# EAGLE design SND_Replacement (EAGLE 9.6.2)
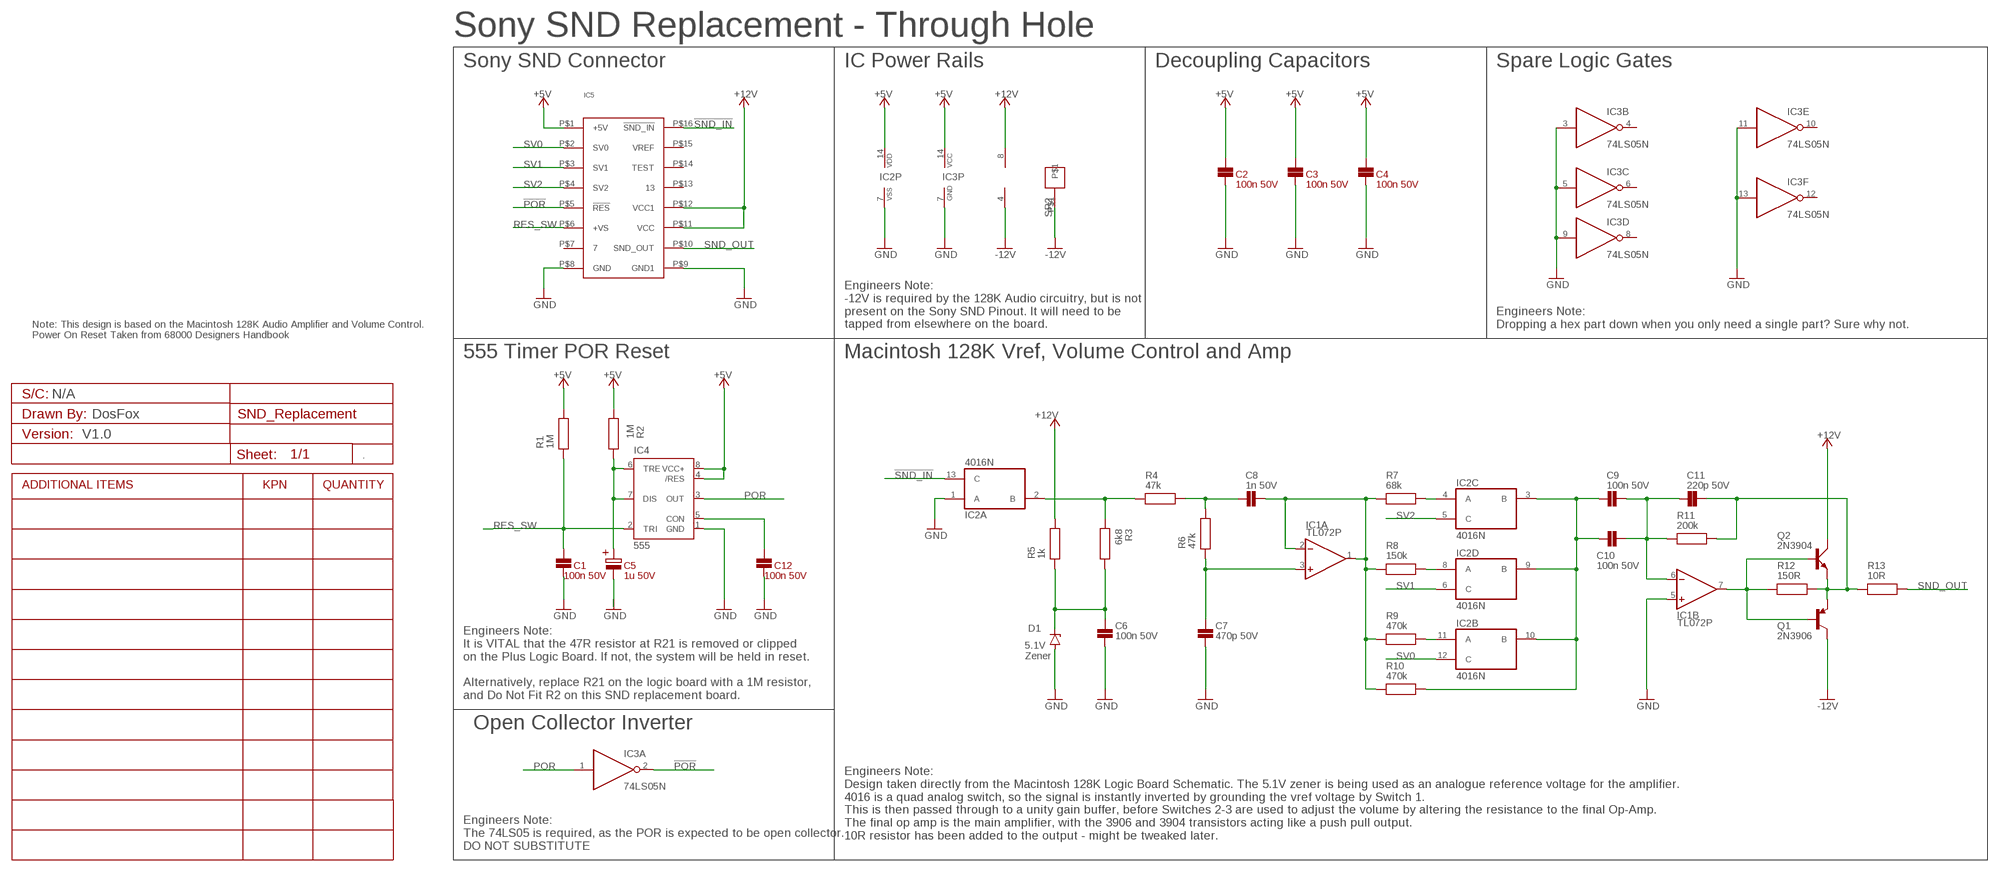
[diagram p0: schematic, sheet 1]

## Parts
A1  V1.0  PROJECT_DETAILS_CUSTOM  [PCB_CUSTOM_DETAILS]
C1  100n 50V  100N_TH_CAP  [CAP_5.08MM_PITCH]
C2  100n 50V  100N_TH_CAP  [CAP_5.08MM_PITCH]
C3  100n 50V  100N_TH_CAP  [CAP_5.08MM_PITCH]
C4  100n 50V  100N_TH_CAP  [CAP_5.08MM_PITCH]
C5  1u 50V  1U_TH_ELEC_CAPVERTICAL  [CAP_ELECTROLYTIC]
C6  100n 50V  100N_TH_CAP  [CAP_5.08MM_PITCH]
C7  470p 50V  470P_TH_CAP  [CAP_5.08MM_PITCH]
C8  1n 50V  1N_TH_CAP  [CAP_5.08MM_PITCH]
C9  100n 50V  100N_TH_CAP  [CAP_5.08MM_PITCH]
C10  100n 50V  100N_TH_CAP  [CAP_5.08MM_PITCH]
C11  220p 50V  220P_TH_CAP  [CAP_5.08MM_PITCH]
C12  100n 50V  100N_TH_CAP  [CAP_5.08MM_PITCH]
D1  ZENER-DIODEF126-10  [F126Z10]
IC1  TL072P  [DIL08]
IC2  4016N  [DIL14]
IC3  74LS05N  [DIL14]
IC4  555  555P  [DIP08]
IC5  SND  [DIP16]
Q1  2N3906  [TO92]
Q2  2N3904  [TO92D]
R1  1M  1M_TH_RESISTOR  [RESISTORTHRUHOLE]
R2  1M  1M_TH_RESISTOR  [RESISTORTHRUHOLE]
R3  6k8  6K8_TH_RESISTOR  [RESISTORTHRUHOLE]
R4  47k  47K_TH_RESISTOR  [RESISTORTHRUHOLE]
R5  1k  1K_TH_RESISTOR  [RESISTORTHRUHOLE]
R6  47k  47K_TH_RESISTOR  [RESISTORTHRUHOLE]
R7  68k  68K_TH_RESISTOR  [RESISTORTHRUHOLE]
R8  150k  150K_TH_RESISTOR  [RESISTORTHRUHOLE]
R9  470k  470K_TH_RESISTOR  [RESISTORTHRUHOLE]
R10  470k  470K_TH_RESISTOR  [RESISTORTHRUHOLE]
R11  200k  100K_TH_RESISTOR  [RESISTORTHRUHOLE]
R12  150R  150K_TH_RESISTOR  [RESISTORTHRUHOLE]
R13  10R  10R_TH_RESISTOR  [RESISTORTHRUHOLE]
SP2  1PIN  [1PIN]

## Nets
!POR: IC3.2(A:O) IC5.P$5(!RES)
!SND_IN: IC2.13(A:C) IC5.P$16(!SND_IN)
+5V: C2.P$2 C3.P$2 C4.P$2 IC2.14(P:VDD) IC3.14(P:VCC) IC4.4(/RES) IC4.8(VCC+) IC5.P$1(+5V) R1.P$2 R2.P$2 ; supply symbol labelled VCC
+12V: IC1.8(P:V+) IC5.P$11(VCC) IC5.P$12(VCC1) Q2.C R5.P$2 ; supply symbol labelled VCC
-12V: IC1.4(P:V-) Q1.1(C) SP2.P$1 ; supply symbol labelled GND
GND: C1.P$1 C2.P$1 C3.P$1 C4.P$1 C5.P$2 C6.P$1 C7.P$1 C12.P$1 D1.A IC1.5(B:+IN) IC2.1(A:A) IC2.7(P:VSS) IC3.3(B:I) IC3.5(C:I) IC3.7(P:GND) IC3.9(D:I) IC3.11(E:I) IC3.13(F:I) IC4.1(GND) IC5.P$8(GND) IC5.P$9(GND1)
N$1: IC2.2(A:B) R3.P$1 R4.P$1
N$2: C12.P$2 IC4.5(CON)
N$3: C9.P$1 C10.P$1 IC2.3(C:B) IC2.9(D:B) IC2.10(B:B) R10.P$2
N$4: C8.P$1 R4.P$2 R6.P$2
N$5: C6.P$2 D1.C R3.P$2 R5.P$1
N$6: C7.P$2 IC1.3(A:+IN) R6.P$1
N$7: IC2.4(C:A) R7.P$2
N$8: IC2.8(D:A) R8.P$2
N$9: IC2.11(B:A) R9.P$2
N$10: C9.P$2 C10.P$2 C11.P$1 IC1.6(B:-IN) R11.P$1
N$12: C8.P$2 IC1.1(A:OUT) IC1.2(A:-IN) R7.P$1 R8.P$1 R9.P$1 R10.P$1
N$13: C11.P$2 Q1.3(E) Q2.E R11.P$2 R12.P$2 R13.P$1
N$15: IC1.7(B:OUT) Q1.2(B) Q2.B R12.P$1
POR: IC3.1(A:I) IC4.3(OUT)
RES_SW: C1.P$2 IC4.2(TRI) IC5.P$6(+VS) R1.P$1
RES_SW1: C5.P$1 IC4.6(TRE) IC4.7(DIS) R2.P$1
SND_OUT: IC5.P$10(SND_OUT) R13.P$2
SV0: IC2.12(B:C) IC5.P$2(SV0)
SV1: IC2.6(D:C) IC5.P$3(SV1)
SV2: IC2.5(C:C) IC5.P$4(SV2)
Unconnected: IC3.4(B:O) IC3.6(C:O) IC3.8(D:O) IC3.10(E:O) IC3.12(F:O) IC5.P$7 IC5.P$13 IC5.P$14(TEST) IC5.P$15(VREF)

## Notes on the sheet
- Sony SND Replacement - Through Hole
- Sony SND Connector | IC Power Rails | Decoupling Capacitors | Spare Logic Gates
- Engineers Note:
  -12V is required by the 128K Audio circuitry, but is not 
  present on the Sony SND Pinout. It will need to be 
  tapped from elsewhere on the board.
- Engineers Note:
  Dropping a hex part down when you only need a single part? Sure why not.
- Note: This design is based on the Macintosh 128K Audio Amplifier and Volume Control. 
  Power On Reset Taken from 68000 Designers Handbook
- 555 Timer POR Reset | Macintosh 128K Vref, Volume Control and Amp
- N/A
- DosFox
- 5.1V
  Zener
- Engineers Note:
  It is VITAL that the 47R resistor at R21 is removed or clipped
  on the Plus Logic Board. If not, the system will be held in reset. 
  
  Alternatively, replace R21 on the logic board with a 1M resistor,
  and Do Not Fit R2 on this SND replacement board.
- Open Collector Inverter
- Engineers Note:
  Design taken directly from the Macintosh 128K Logic Board Schematic. The 5.1V zener is being used as an analogue reference voltage for the amplifier. 
  4016 is a quad analog switch, so the signal is instantly inverted by grounding the vref voltage by Switch 1. 
  This is then passed through to a unity gain buffer, before Switches 2-3 are used to adjust the volume by altering the resistance to the final Op-Amp. 
  The final op amp is the main amplifier, with the 3906 and 3904 transistors acting like a push pull output.
  10R resistor has been added to the output - might be tweaked later.
- Engineers Note:
  The 74LS05 is required, as the POR is expected to be open collector.
  DO NOT SUBSTITUTE

## Library data of the parts
A1 = Schematic Symbols:PROJECT_DETAILS; VALUE: VDEV1
C1-C4 C6 C9 C10 C12 = Capacitors TH:100N_TH_CAP; COMPONENT: Capacitor; COST: =(INDIRECT(ADDRESS(ROW(),1)))*(INDIRECT(ADDRESS(ROW(),13))); EA: =VLOOKUP(INDIRECT(ADDRESS(ROW(),7)),[ProductCosts.xlsx]StockCosts!$A:$B,2,FALSE); KPN: 3101-100N; PACKAGE: 5.08mm PITCH; PROCESS: TH
C5 = Capacitors TH:1U_TH_ELEC_CAP; COMPONENT: Capacitor Electrolytic; COST: =(INDIRECT(ADDRESS(ROW(),1)))*(INDIRECT(ADDRESS(ROW(),13))); EA: =VLOOKUP(INDIRECT(ADDRESS(ROW(),7)),[ProductCosts.xlsx]StockCosts!$A:$B,2,FALSE); KPN: 3102-1U; PACKAGE: 5mm DIA; PROCESS: TH
C7 = Capacitors TH:470P_TH_CAP; COMPONENT: Capacitor; COST: =(INDIRECT(ADDRESS(ROW(),1)))*(INDIRECT(ADDRESS(ROW(),13))); EA: =VLOOKUP(INDIRECT(ADDRESS(ROW(),7)),[ProductCosts.xlsx]StockCosts!$A:$B,2,FALSE); KPN: 3101-470P; PACKAGE: 5.08mm PITCH; PROCESS: TH
C8 = Capacitors TH:1N_TH_CAP; COMPONENT: Capacitor; COST: =(INDIRECT(ADDRESS(ROW(),1)))*(INDIRECT(ADDRESS(ROW(),13))); EA: =VLOOKUP(INDIRECT(ADDRESS(ROW(),7)),[ProductCosts.xlsx]StockCosts!$A:$B,2,FALSE); KPN: 3101-1N; PACKAGE: 5.08mm PITCH; PROCESS: TH
C11 = Capacitors TH:220P_TH_CAP; COMPONENT: Capacitor; COST: =(INDIRECT(ADDRESS(ROW(),1)))*(INDIRECT(ADDRESS(ROW(),13))); EA: =VLOOKUP(INDIRECT(ADDRESS(ROW(),7)),[ProductCosts.xlsx]StockCosts!$A:$B,2,FALSE); KPN: 3101-220P; PACKAGE: 5.08mm PITCH; PROCESS: TH
D1 = diode:ZENER-DIODE: Z-Diode
IC1 = linear:TL072: OP AMP
IC2 = 40xx:4016: Quad bilateral ANALOG SWITCH
IC3 = 74xx-eu:74*05: Hex INVERTER, open collector
IC4 = SparkFun-IC-Special-Function:555: General purpose bipolar Timer Datasheet <http://www.sparkfun.com/datasheets/Components/General/ne555.pdf> SparkFun Products SparkFun SparkPunk Sequencer Kit <https://www.sparkfun.com/products/12707> (KIT-12707) Storefront Component: 555 Timer <https://www.sparkfun.com/products/9273> (COM-09273) Two parts valid for production: VFP: IC-11930 (M7555 PTH) VFP: IC-09173 (555 PTH) - Preferred; PROD_ID: IC-09173; PROD_ID_ALT: IC-09173
IC5 = ICs:SND; PACKAGE: DIP16; PROCESS: TH
Q1 = transistor-pnp:2N3906: PNP Transistor
Q2 = transistor-small-signal:2N3904: NPN TRANSISTOR
R1 R2 = Resistors TH:1M_TH_RESISTOR; COMPONENT: Resistor; COST: =(INDIRECT(ADDRESS(ROW(),1)))*(INDIRECT(ADDRESS(ROW(),13))); EA: =(VLOOKUP(INDIRECT(ADDRESS(ROW(),6)),[ProductCosts.xlsx]StockCosts!$A:$B,2,FALSE))/1000; KPN: 3004-1M; PACKAGE: Axial Leaded; PROCESS: TH
R3 = Resistors TH:6K8_TH_RESISTOR; COMPONENT: Resistor; COST: =(INDIRECT(ADDRESS(ROW(),1)))*(INDIRECT(ADDRESS(ROW(),13))); EA: =(VLOOKUP(INDIRECT(ADDRESS(ROW(),6)),[ProductCosts.xlsx]StockCosts!$A:$B,2,FALSE))/1000; KPN: 3004-6k8; PACKAGE: Axial Leaded; PROCESS: TH
R4 R6 = Resistors TH:47K_TH_RESISTOR; COMPONENT: Resistor; COST: =(INDIRECT(ADDRESS(ROW(),1)))*(INDIRECT(ADDRESS(ROW(),13))); EA: =(VLOOKUP(INDIRECT(ADDRESS(ROW(),6)),[ProductCosts.xlsx]StockCosts!$A:$B,2,FALSE))/1000; KPN: 3004-47k; PACKAGE: Axial Leaded; PROCESS: TH
R5 = Resistors TH:1K_TH_RESISTOR; COMPONENT: Resistor; COST: =(INDIRECT(ADDRESS(ROW(),1)))*(INDIRECT(ADDRESS(ROW(),13))); EA: =(VLOOKUP(INDIRECT(ADDRESS(ROW(),6)),[ProductCosts.xlsx]StockCosts!$A:$B,2,FALSE))/1000; KPN: 3004-1k; PACKAGE: Axial Leaded; PROCESS: TH
R7 = Resistors TH:68K_TH_RESISTOR; COMPONENT: Resistor; COST: =(INDIRECT(ADDRESS(ROW(),1)))*(INDIRECT(ADDRESS(ROW(),13))); EA: =(VLOOKUP(INDIRECT(ADDRESS(ROW(),6)),[ProductCosts.xlsx]StockCosts!$A:$B,2,FALSE))/1000; KPN: 3004-68k; PACKAGE: Axial Leaded; PROCESS: TH
R8 = Resistors TH:150K_TH_RESISTOR; COMPONENT: Resistor; COST: =(INDIRECT(ADDRESS(ROW(),1)))*(INDIRECT(ADDRESS(ROW(),13))); EA: =(VLOOKUP(INDIRECT(ADDRESS(ROW(),6)),[ProductCosts.xlsx]StockCosts!$A:$B,2,FALSE))/1000; KPN: 3004-150k; PACKAGE: Axial Leaded; PROCESS: TH
R9 R10 = Resistors TH:470K_TH_RESISTOR; COMPONENT: Resistor; COST: =(INDIRECT(ADDRESS(ROW(),1)))*(INDIRECT(ADDRESS(ROW(),13))); EA: =(VLOOKUP(INDIRECT(ADDRESS(ROW(),6)),[ProductCosts.xlsx]StockCosts!$A:$B,2,FALSE))/1000; KPN: 3004-470k; PACKAGE: Axial Leaded; PROCESS: TH
R11 = Resistors TH:100K_TH_RESISTOR; COMPONENT: Resistor; COST: =(INDIRECT(ADDRESS(ROW(),1)))*(INDIRECT(ADDRESS(ROW(),13))); EA: =(VLOOKUP(INDIRECT(ADDRESS(ROW(),6)),[ProductCosts.xlsx]StockCosts!$A:$B,2,FALSE))/1000; KPN: 3004-100k; PACKAGE: Axial Leaded; PROCESS: TH; VALUE: 100k
R12 = Resistors TH:150K_TH_RESISTOR; COMPONENT: Resistor; COST: =(INDIRECT(ADDRESS(ROW(),1)))*(INDIRECT(ADDRESS(ROW(),13))); EA: =(VLOOKUP(INDIRECT(ADDRESS(ROW(),6)),[ProductCosts.xlsx]StockCosts!$A:$B,2,FALSE))/1000; KPN: 3004-150k; PACKAGE: Axial Leaded; PROCESS: TH; VALUE: 150k
R13 = Resistors TH:10R_TH_RESISTOR; COMPONENT: Resistor; COST: =(INDIRECT(ADDRESS(ROW(),1)))*(INDIRECT(ADDRESS(ROW(),13))); EA: =(VLOOKUP(INDIRECT(ADDRESS(ROW(),6)),[ProductCosts.xlsx]StockCosts!$A:$B,2,FALSE))/1000; KPN: 3004-10R; PACKAGE: Axial Leaded; PROCESS: TH
SP2 = generic parts:1PIN

## Board
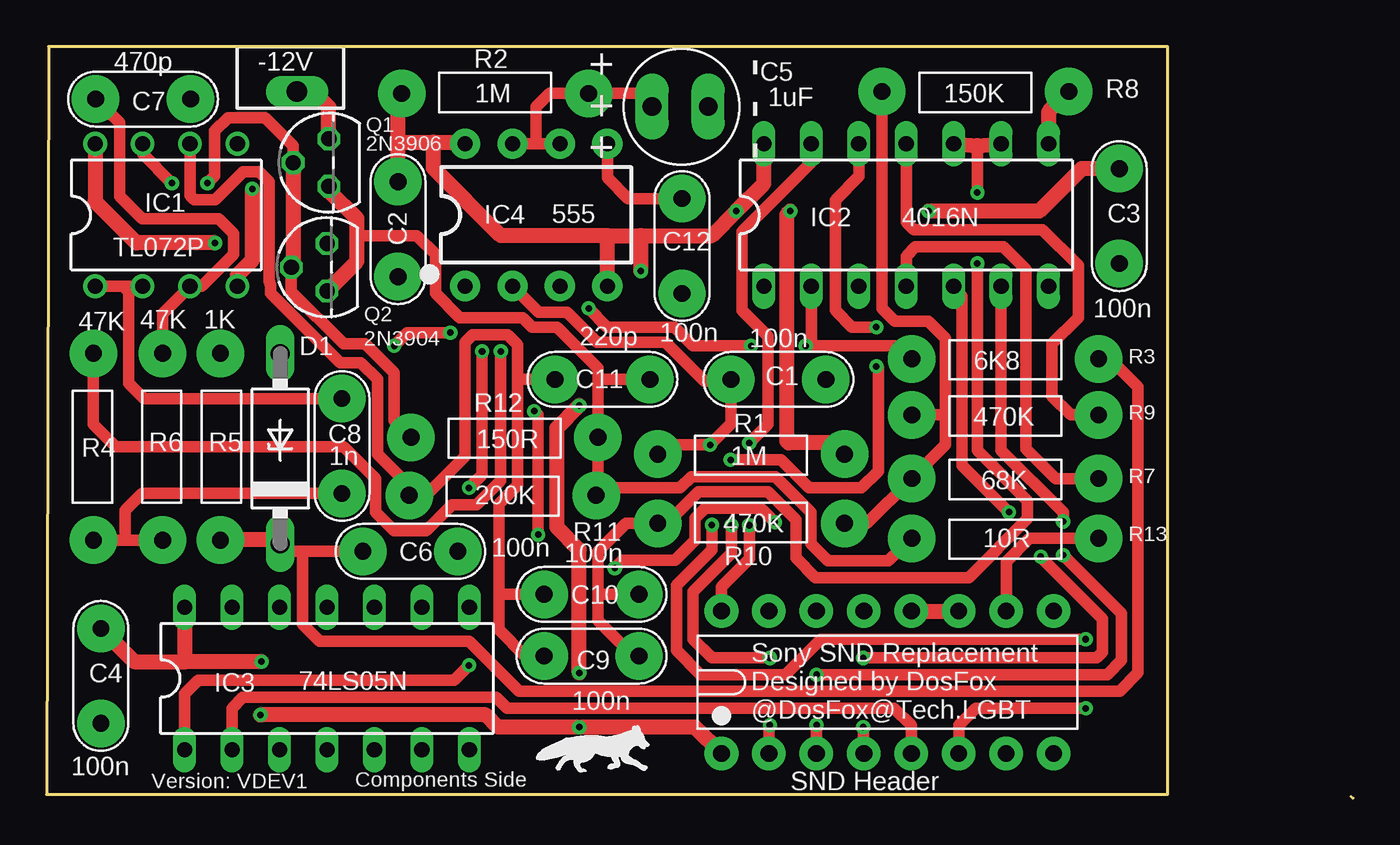
[diagram p1: board, top side]
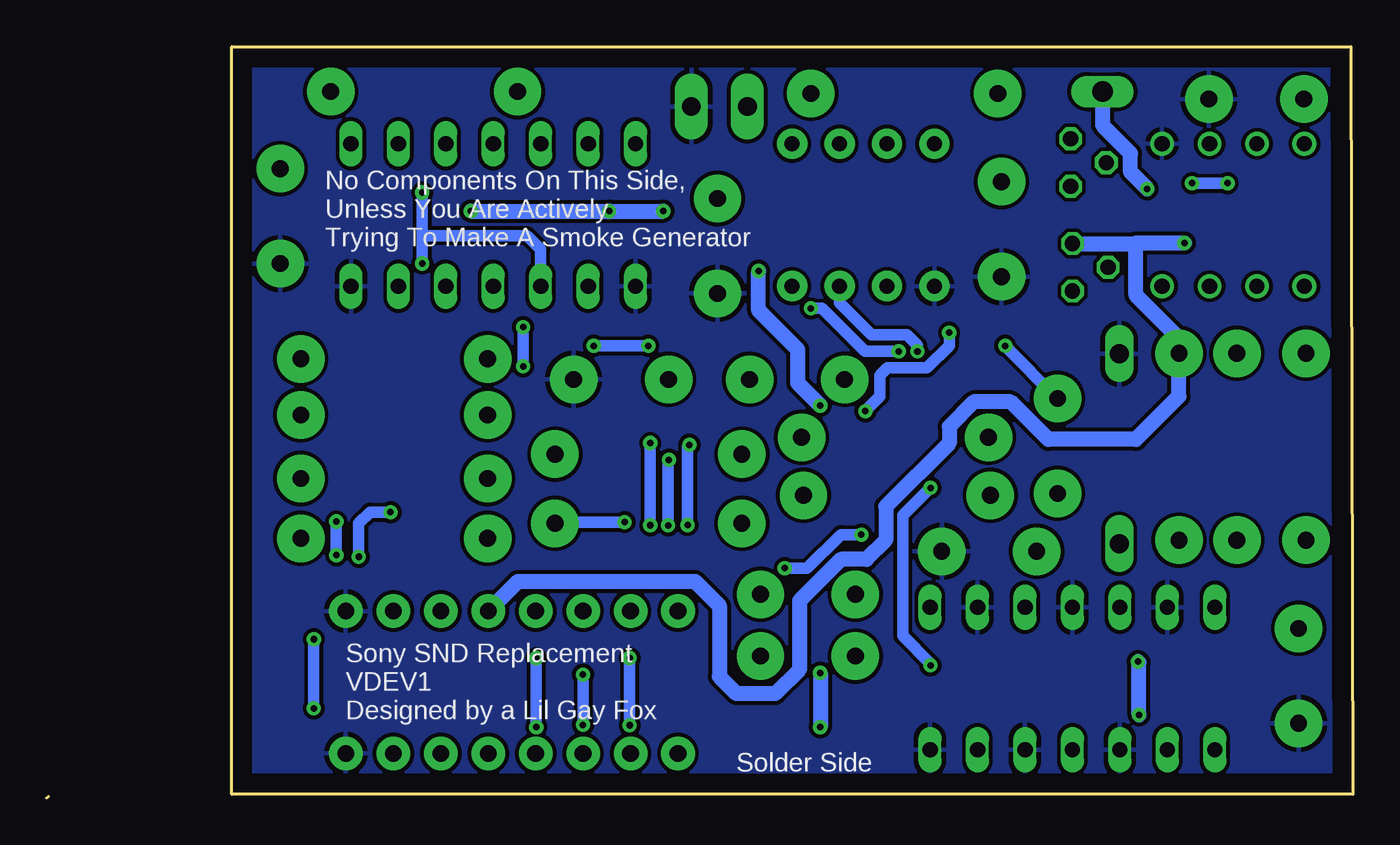
[diagram p2: board, bottom side, seen from below]

Size 69.9 x 40.2 mm. Coordinates in mm from the lower left corner, seen from the top.
Outline: 69.8,0.1 69.9,0
Outline: 0,0.2 60,0.2 60,40.2 0.1,40.2 0,0.2
Copper layers (1*16): Top 0.035mm / dielectric 1.5mm / Bottom 0.035mm
Design rules "default *": minimum track width 0.2mm, minimum drill 0.25mm, track to track 8mil, track to pad 8mil, pad to pad 8mil, via to via 8mil, smd to smd 8mil, copper to edge 40mil, drill to drill 8mil, minimum pad ring 1mil, minimum via ring 8mil, stop-mask expansion 4mil, vias tented up to drill 1mm, thermal gap 10mil

### Footprints (pad centres in the part's own frame; a part is rotated, then mirrored left to right if it is on the bottom)
CAP_5.08MM_PITCH = drill 0.9 pad 2.54: P$1 0,0; P$2 0,-5.08
CAP_ELECTROLYTIC = drill 1 pad 1.778 long: P$1 0,0; P$2 0,-3
F126Z10 = drill 1.016 long: A 5.08,0; C -5.08,0
DIL08 = drill 0.813 pad 1.27: 1 -3.81,-3.81; 2 -1.27,-3.81; 3 1.27,-3.81; 4 3.81,-3.81; 5 3.81,3.81; 6 1.27,3.81; 7 -1.27,3.81; 8 -3.81,3.81
DIL14 = drill 0.813 long: 1 -7.62,-3.81; 2 -5.08,-3.81; 3 -2.54,-3.81; 4 0,-3.81; 5 2.54,-3.81; 6 5.08,-3.81; 7 7.62,-3.81; 8 7.62,3.81; 9 5.08,3.81; 10 2.54,3.81; 11 0,3.81; 12 -2.54,3.81; 13 -5.08,3.81; 14 -7.62,3.81
DIP08 = drill 0.813 pad 1.626: 1 -3.81,-3.81; 2 -1.27,-3.81; 3 1.27,-3.81; 4 3.81,-3.81; 5 3.81,3.81; 6 1.27,3.81; 7 -1.27,3.81; 8 -3.81,3.81
DIP16 = drill 0.9 pad 1.8: P$1 -8.89,-3.81; P$2 -6.35,-3.81; P$3 -3.81,-3.81; P$4 -1.27,-3.81; P$5 1.27,-3.81; P$6 3.81,-3.81; P$7 6.35,-3.81; P$8 8.89,-3.81; P$9 8.89,3.81; P$10 6.35,3.81; P$11 3.81,3.81; P$12 1.27,3.81; P$13 -1.27,3.81; P$14 -3.81,3.81; P$15 -6.35,3.81; P$16 -8.89,3.81
TO92 = drill 0.813 octagon: 1 1.27,0; 2 0,1.905; 3 -1.27,0
TO92D = drill 0.813 octagon: B 0,1.905; C 1.27,0; E -1.27,0
RESISTORTHRUHOLE = drill 0.9 pad 2.54: P$1 0,0; P$2 10,0
1PIN = drill 1.1 pad 1.676 long: P$1 0,0

### Placement (x,y rotation side)
A1  -120.65,1.47 0 top  (outside the outline)
C1  41.7,22.4 270 top
C2  18.8,27.9 180 top
C3  57.4,28.6 180 top
C4  2.9,4 180 top
C5  32.4,37 90 top
C6  22,13.2 270 top
C7  7.7,37.4 270 top
C8  15.8,16.3 180 top
C9  31.7,7.6 270 top
C10  31.7,10.9 270 top
C11  27.2,22.4 90 top
C12  34,27 180 top
D1  12.5,18.7 90 top
IC1  6.4,31.2 0 top
IC2  46,31.2 0 top
IC3  15,6.4 0 top
IC4  26.2,31.2 0 top
IC5  45,6.2 0 top
Q1  15.1,34 90 top
Q2  15,28.4 90 top
R1  32.7,18.4 0 top
R2  29,37.7 180 top
R3  46.3,23.5 0 top
R4  2.5,23.8 270 top
R5  9.3,13.8 90 top
R6  6.2,23.8 270 top
R7  46.3,17.1 0 top
R8  44.7,37.8 0 top
R9  46.3,20.5 0 top
R10  42.7,14.7 180 top
R11  19.4,16.2 0 top
R12  19.5,19.3 0 top
R13  46.3,13.9 0 top
SP2  13.4,37.8 180 top

### Tracks (layer width: path | path; a pad name or v marks a point on that pad's centre or on a via)
!POR
  Top 0.61: IC5.P$5 46.27,3.89 45.35,4.81 24.65,4.81 24.06,5.4 10.5,5.4 9.92,4.82 IC3.2
!SND_IN  (via drill 0.35)
  Top 0.61: v37.6,14.6 37.6,12.8 36.11,11.31 IC5.P$16 | v37.6,19 38.6,20 38.6,24.7 37.2,26.1 37.2,30.29 40.92,34.01 IC2.13
  Bottom 0.61: v37.6,19 v37.6,14.6
+5V  (via drill 0.35)
  Top 0.813: C2.P$2 18.8,35.1 | 18.8,35.1 18.8,37.5 R2.P$2 | 18.8,35.1 20.7,35.1 | 20.7,35.1 22.3,35.1 IC4.8 | IC4.4 30.01,30.1 | 20.7,35.1 20.7,33.7 24.3,30.1 30.01,30.1 | IC5.P$1 34.7,3.8 v28.5,3.8 24.17,3.8 23.51,4.45 v11.45,4.45 | C4.P$2 4.68,7.3 7.5,7.3 | 30.01,30.1 31.8,30.1 | 31.8,30.1 35.6,30.1 v36.9,31.4 38.38,32.88 IC2.14 | C3.P$2 55.4,33.68 53.12,31.4 v47.2,31.4 | v28.5,21 27.3,19.8 27.3,14.5 28.5,13.3 v28.5,6.7 | v31.8,28.2 31.8,30.1 | R1.P$2 42.1,19 39.7,19 39.6,19.1 39.6,31.2 v39.8,31.4 | v11.5,7.3 7.5,7.3 | IC3.14 7.38,7.42 7.5,7.3
  Bottom 0.813: v11.45,4.45 11.45,7.25 v11.5,7.3 | v28.5,6.7 v28.5,3.8 | v47.2,31.4 v39.8,31.4 v36.9,31.4 | v28.5,21 29.7,22.2 29.7,24 31.8,26.1 v31.8,28.2
+12V  (via drill 0.35)
  Top 0.813: IC5.P$12 IC5.P$11 | IC1.8 2.59,31.91 4.8,29.7 v9.01,29.7
  Bottom 0.813: 11.6,29.7 11.6,26.9 9.3,24.6 R5.P$2 9.3,21.5 11.6,19.2 16.3,19.2 18.3,21.2 20.29,21.2 21.6,19.89 21.6,19 24.99,15.6 24.99,13.81 26.02,12.78 27.4,12.78 29.6,10.58 29.6,6.9 30.9,5.6 33,5.6 33.9,6.5 33.9,10.3 35.2,11.6 44.68,11.6 IC5.P$12 | 11.6,29.7 v9.01,29.7 | Q2.C 11.63,29.67 11.6,29.7
-12V  (via drill 0.35)
  Top 0.813: Q1.1 15.1,36.97 14.27,37.8 SP2.P$1 | v11,32.6 11,28.78 10.21,27.99 IC1.4
  Bottom 0.813: v11,32.6 11.9,33.5 11.9,34.5 13.4,36 SP2.P$1
GND
  pour Bottom: 0.1,40.2 0.1,0.1 60.1,0.2 60.1,40.2
N$1  (via drill 0.35)
  Top 0.61: IC2.2 40.92,24.2 v40.62,24.2 45.46,24.2 R3.P$1 | v37.7,24.2 34.6,24.2 33.6,25.2 30,25.2 v29,26.2 | R4.P$1 2.5,20 3.7,18.8 15.9,18.8 17.6,17.1 17.6,15.3 18.6,14.3 20.3,14.3 21.7,15.7 23,15.7 24.29,16.99 24.29,23.89 v24.3,23.9
  Bottom 0.61: v40.62,24.2 v37.7,24.2 | v29,26.2 28.4,26.2 26.1,23.9 v24.3,23.9
N$2
  Top 0.61: C12.P$2 31.12,32.08 30.01,33.19 IC4.5
N$3  (via drill 0.35)
  Top 0.61: C9.P$1 31.4,7.6 29.5,9.5 29.5,10.9 | 29.5,10.9 29.5,13.2 31,14.7 R10.P$2 33.2,14.7 34.89,16.39 38.6,16.39 40.09,14.9 40.09,12.86 41.15,11.8 49.35,11.8 52.49,14.94 52.49,15.91 49.8,18.6 v49.8,28.6 | C10.P$1 29.5,10.9 | 49.8,34.91 v49.8,32.4
  Top 0.813: IC2.10 49.8,34.91 IC2.9
  Bottom 0.61: v49.8,32.4 49.8,30.1 | 49.8,30.1 v49.8,28.6 | IC2.3 43.46,29.36 44.2,30.1 49.8,30.1
N$4
  Top 0.61: R6.P$2 4.2,13.8 | 4.2,13.8 R4.P$2 | 4.2,13.8 4.2,15.4 5.1,16.3 C8.P$1
N$5
  Top 0.61: R3.P$2 56.9,23.5 58.4,22 58.4,6.7 57.42,5.72 25.28,5.72 22.61,8.4 14.6,8.4 13.7,9.3 13.7,13.22 | C6.P$2 16.92,13.22 13.7,13.22 | 13.7,13.22 12.5,13.22 D1.C 12.4,13.62
  Top 0.813: 12.4,13.62 12.2,13.82 9.32,13.82 R5.P$1
N$6
  Top 0.61: R6.P$1 6.2,25.92 IC1.3 8.29,27.39 10,29.1 10,30.2 9.2,31 5.1,31 3.9,32.2 3.9,36.12 C7.P$2
N$7
  Top 0.61: R7.P$2 54,17.1 52.4,18.7 52.4,28.3 51.2,29.5 46.5,29.5 46,29 IC2.4
N$8
  Top 0.813: R8.P$2 53.62,36.71 IC2.8
N$9
  Top 0.61: R9.P$2 54.8,20.5 53.8,21.5 53.8,24.3 55.2,25.7 55.2,28.5 53.3,30.4 46.4,30.4 46,30.8 IC2.11
N$10
  Top 0.61: C9.P$2 25.6,7.6 24.2,9 24.2,11.1 | C11.P$1 25.2,22.4 | 25.2,22.4 25.2,24.25 24.65,24.8 22.8,24.8 22.4,24.4 22.4,18.3 20.3,16.2 R11.P$1 19.4,16.7 17.7,18.4 17.7,22.4 16.8,23.3 15.7,23.3 11.98,27.02 11.98,27.43 11.91,27.69 11.91,32.98 11.38,33.51 10.51,33.51 9.01,32.01 7.89,32.01 7.67,32.23 IC1.6 | 25.2,22.4 25.2,16.75 24.2,15.75 24.2,11.1 | C10.P$2 24.4,10.9 24.2,11.1
N$12  (via drill 0.35)
  Top 0.61: R10.P$1 43.9,14.7 R7.P$1 48.1,18.9 48.1,20.5 | R8.P$1 44.7,26.2 45.4,25.5 47.2,25.5 48.1,24.6 48.1,20.5 | R9.P$1 48.1,20.5 | C8.P$2 5.22,21.38 4.4,22.2 4.4,27.09 4.1,27.39 | v21.6,24.9 19.3,24.9 v18.6,24.2 | v26.09,20.7 26.29,20.5 26.29,14.11 v26.3,14.1 | v30.4,12.3 30.82,12.72 33.62,12.72 34.7,13.8 34.7,14.97 35.23,15.5 38.23,15.5 v38.97,14.77 | IC1.1 4.1,27.39 | 4.1,27.39 IC1.2
  Bottom 0.61: v18.6,24.2 18.6,24.18 C8.P$2 | v30.4,12.3 29.2,12.3 27.4,14.1 v26.3,14.1 | R10.P$1 42.63,14.77 v38.97,14.77 | v21.6,24.9 21.6,24.2 22.79,23.01 24.9,23.01 25.3,22.61 25.3,21.5 26.09,20.71 v26.09,20.7
N$13
  Top 0.61: R13.P$1 46.25,13.9 45.05,12.7 41.8,12.7 40.9,13.6 40.9,15.3 39,17.2 34.5,17.2 33.9,16.6 29.8,16.6 R11.P$2 29.1,16.5 29.1,16.7 29.5,16.7 R12.P$2 29.5,22.4 | 16.6,30.1 19.8,30.1 20.8,29.1 20.8,27 22.1,25.7 25.47,25.7 25.98,25.19 27.31,25.19 29.5,23 29.5,22.4 | C11.P$2 29.5,22.4
  Top 0.813: Q2.E 16.6,28.73 16.6,30.1 16.6,31 15.1,32.5 Q1.3
N$15  (via drill 0.35)
  Top 0.61: R12.P$1 18.6,20.2 18.6,22.75 17.05,24.3 15.89,24.3 13.1,27.1 Q2.B | v8.6,32.9 9,33.3 9,35.7 9.7,36.4 11.7,36.4 13.2,34.9 Q1.2 | v6.7,32.9 5.13,34.47 IC1.7
  Top 0.813: Q1.2 13.2,28.5 Q2.B
  Bottom 0.61: v8.6,32.9 v6.7,32.9
POR  (via drill 0.35)
  Top 0.61: IC3.1 7.38,5.58 8.1,6.3 21.8,6.3 v22.6,7.1 | v23.3,23.9 23.3,17.3 v22.6,16.6
  Bottom 0.61: v22.6,16.6 22.61,16.6 24.08,15.14 24.08,8.68 22.6,7.2 v22.6,7.1 | IC4.3 27.47,26.49 25.77,24.79 23.87,24.79 23.3,24.22 v23.3,23.9
RES_SW  (via drill 0.35)
  Top 0.61: v55.61,4.81 49.73,4.81 48.81,3.89 IC5.P$6 | v35.6,14.61 35.6,13.3 33.7,11.4 33.7,7.9 35,6.6 39.54,6.6 41.44,8.5 v55.6,8.5 | R1.P$1 33.2,18.9 v35.5,18.9 36.62,20.02 C1.P$2 36.52,22.3 35.2,22.3 33.11,24.39 29.46,24.39 27.85,26 26.32,26 IC4.2
  Bottom 0.61: v55.6,8.5 v55.61,8.49 v55.61,4.81 | v35.5,18.9 35.6,18.8 v35.6,14.61
RES_SW1
  Top 0.61: IC4.7 26.2,35.01 | 26.2,35.01 IC4.6 | 26.2,35.01 26.2,37 26.9,37.7 R2.P$1 32,37.7 32.4,37.3 C5.P$1
SND_OUT
  Top 0.61: IC5.P$10 51.35,12.65 52.6,13.9 R13.P$2
SV0  (via drill 0.35)
  Top 0.61: IC2.12 43.46,33.26 42.2,32 42.2,26.1 43.1,25.2 v44.4,25.2 | v44.4,23.1 44.5,23 44.5,17.49 43.61,16.6 40.8,16.6 39.3,18.1 v36.6,18.1 | IC5.P$2 38.65,3.85 v38.7,3.9 | v38.7,7.5 35.6,7.5 34.6,8.5 34.6,11.05 36.21,12.66 36.21,12.67 36.64,13.1 v36.64,14.6
  Bottom 0.61: v44.4,25.2 v44.4,23.1 | v38.7,7.5 v38.7,3.9 | v36.6,18.1 36.64,18.1 v36.64,14.6
SV1  (via drill 0.35)
  Top 0.61: IC2.6 51.08,18.62 54.4,15.3 v54.4,14.8 | v54.4,13 57.51,9.89 57.51,7.36 56.76,6.61 v41.2,6.61 | v41.2,3.92 IC5.P$3
  Bottom 0.61: v54.4,14.8 v54.4,13 | v41.2,6.61 v41.2,3.92
SV2  (via drill 0.35)
  Top 0.61: IC2.5 48.99,26.84 48.99,17.81 v51.5,15.3 | v53.2,12.91 v53.2,12.9 56.5,9.6 56.5,7.8 56.21,7.51 43.71,7.51 v43.7,7.5 | v43.7,3.8 43.7,2.42 IC5.P$4
  Bottom 0.61: v51.5,15.3 52.6,15.3 53.2,14.7 v53.2,12.91 | v43.7,7.5 v43.7,3.8

### Text on the board
tNames: 470p | -12V | 1M | 1uF | 150K | 100n | 47K | 47K | 1K | 220p | 100n | 100n | 6K8 | 470K | 1n | 150R | 1M | 200K | 68K | 470K | 100n | 10R | 100n | 100n | Sony SND Replacement / Designed by DosFox / @DosFox@Tech.LGBT | 100n | Components Side | SND Header | Version: VDEV1
bNames: No Components On This Side, / Unless You Are Actively / Trying To Make A Smoke Generator | Sony SND Replacement / VDEV1 / Designed by a Lil Gay Fox | Solder Side
tDocu: RP2040 Development Board | Yes | Yes | 40mm x 54.5mm | Yes | 2 | Yes | Yes | Yes | No | HASL (Lead Free) | Yes | Green (Both Sides) | Yes | White (Both Sides) | Yes | Yes | Yes | No | No | No